# Altium project RFM95W915MHz.PrjPcb
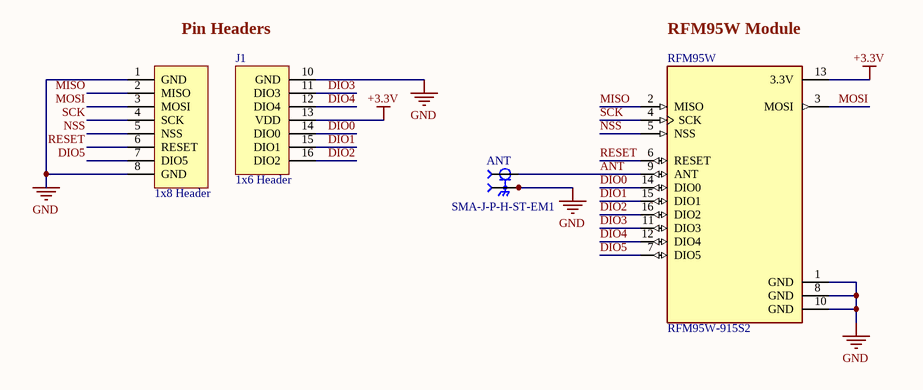
[diagram p0: RFM95W.SchDoc]
1 sheet, 4 parts. Net scope: global (net labels, ports and power ports of the same name join across sheets).
Board file: RFM95W.PcbDoc

## Sheet RFM95W.SchDoc
size A

### Parts
ANT  SMA-J-P-H-ST-EM1  [SAMTEC_SMA-J-P-H-ST-EM1]
J1  1x6 Header  [HDR1X7]
J2  1x8 Header  [HDR1X8]
RFM95W  RFM95W-915S2  [XCVR_RFM95W-915S2]

### Nets
+3.3V: J1.13(VDD) RFM95W.13(3.3V)
GND: ANT.2_1 ANT.2_2 ANT.3_1 ANT.3_2 J1.10(GND) J2.1(GND) J2.8(GND) RFM95W.1(GND) RFM95W.8(GND) RFM95W.10(GND)
ANT: ANT.1 RFM95W.9(ANT)
DIO0: J1.14(DIO0) RFM95W.14(DIO0)
DIO1: J1.15(DIO1) RFM95W.15(DIO1)
DIO2: J1.16(DIO2) RFM95W.16(DIO2)
DIO3: J1.11(DIO3) RFM95W.11(DIO3)
DIO4: J1.12(DIO4) RFM95W.12(DIO4)
DIO5: J2.7(DIO5) RFM95W.7(DIO5)
MISO: J2.2(MISO) RFM95W.2(MISO)
MOSI: J2.3(MOSI) RFM95W.3(MOSI)
NSS: J2.5(NSS) RFM95W.5(NSS)
RESET: J2.6(RESET) RFM95W.6(RESET)
SCK: J2.4(SCK) RFM95W.4(SCK)

### Notes on the sheet
- Pin Headers
- (near RFM95W) RFM95W Module

### Library data of the parts
ANT = SMA-J-P-H-ST-EM1: SMA Connector Jack, Female Socket 50Ohm Board Edge, End Launch Solder; MF: Samtec; SnapEDA_Link: https://www.snapeda.com/parts/SMA-J-P-H-ST-EM1/Samtec%20Inc./view-part/134500/?ref=snap; MP: SMA-J-P-H-ST-EM1; Toby_UK-Purchase-URL: https://snapeda.com/shop?store=Toby+UK&id=134500; Value: *; Package: None; Digi-Key_Part_Number: SAM8857-ND
J1 = 22-10-2061_1: CONN HEADER VERT 7POS 2.54MM; Manufacturer: Molex; Contact Resistance: 10mR; Number of Contacts: 6; Gender: Male; Current Rating: 4A; Voltage Rating: 250V; Insulation Resistance: 50GR; Connector Type: Male Pin; Glow Wire Compliant: Non-compliant; Supplier 1: Digi-Key; Manufacturer Part Number: 22-10-2061; RoHS: Yes; Category: Headers and Wire Housings; Stock 1: 3643; Pricing 1: 1=1.33000, 10=1.10400, 100=0.92000, 1000=0.73600, 5000=0.64400, 10000=0.61180 (USD); Mount: Through Hole; Contact Plating: Gold,Copper,Tin; Contact Material: Brass; Housing Color: Black; Housing Material: Nylon; Color: White; Min Operating Temperature: 0°C; Max Operating Temperature: 75°C; Number of Rows: 1; Packaging: Bulk; Termination: Solder; Orientation: Straight; Package Quantity: 10; Number of Positions: 6; Voltage Rating (DC): 250V; Number of Circuits: 6; Series: KK® 4030; Contact Type: Male Pin; Length: 95mm; Height: 14.68mm; Pitch: 2.54mm; Depth: 9.02mm; Contact Mating Length: 0.295inch; Radiation Hardening: No; RoHS Compliant: Yes; REACH SVHC: Unknown; Halogen Free: Low Halogen; Flammability Rating: UL94 V-0; ComponentLink1URL: https://datasheet.ciiva.com/711/022032041-sd-711929.pdf?src-supplier=Digi-Key; ComponentLink1Description: https://datasheet.ciiva.com/711/022032041-sd-711929.pdf?src-supplier=Digi-Key; ComponentLink2URL: https://datasheet.ciiva.com/5158/0022102061-pcb-headers-158488-5158499.pdf?src-supplier=Mouser; ComponentLink2Description: https://datasheet.ciiva.com/5158/0022102061-pcb-headers-158488-5158499.pdf?src-supplier=Mouser; ComponentLink3URL: https://datasheet.ciiva.com/10086/0022102061-pcb-headers-10086323.pdf?src-supplier=Avnet; ComponentLink3Description: https://datasheet.ciiva.com/10086/0022102061-pcb-headers-10086323.pdf?src-supplier=Avnet; ComponentLink4URL: https://datasheet.ciiva.com/19461/1965971-19461525.pdf?src-supplier=Jameco; ComponentLink4Description: https://datasheet.ciiva.com/19461/1965971-19461525.pdf?src-supplier=Jameco; ComponentLink5URL: https://datasheet.ciiva.com/30196/0022102061-pcb-headers-30196683.pdf?src-supplier=Onlinecomponents.com; ComponentLink5Description: https://datasheet.ciiva.com/30196/0022102061-pcb-headers-30196683.pdf?src-supplier=Onlinecomponents.com; ComponentLink6URL: https://datasheet.ciiva.com/16727/0022102061-pcb-headers-16727098.pdf?src-supplier=Avnet+Europe; ComponentLink6Description: https://datasheet.ciiva.com/16727/0022102061-pcb-headers-16727098.pdf?src-supplier=Avnet+Europe; Supplier Part Number 1: 23-0022102071-ND
J2 = 22-10-2061: CONN HEADER VERT 8POS 2.54MM; Manufacturer: Molex; Contact Resistance: 10mR; Number of Contacts: 6; Gender: Male; Current Rating: 4A; Voltage Rating: 250V; Insulation Resistance: 50GR; Connector Type: Male Pin; Glow Wire Compliant: Non-compliant; Supplier 1: Digi-Key; Manufacturer Part Number: 22-10-2061; RoHS: Yes; Category: Headers and Wire Housings; Stock 1: 3643; Pricing 1: 1=1.33000, 10=1.10400, 100=0.92000, 1000=0.73600, 5000=0.64400, 10000=0.61180 (USD); Mount: Through Hole; Contact Plating: Gold,Copper,Tin; Contact Material: Brass; Housing Color: Black; Housing Material: Nylon; Color: White; Min Operating Temperature: 0°C; Max Operating Temperature: 75°C; Number of Rows: 1; Packaging: Bulk; Termination: Solder; Orientation: Straight; Package Quantity: 10; Number of Positions: 6; Voltage Rating (DC): 250V; Number of Circuits: 6; Series: KK® 4030; Contact Type: Male Pin; Length: 95mm; Height: 14.68mm; Pitch: 2.54mm; Depth: 9.02mm; Contact Mating Length: 0.295inch; Radiation Hardening: No; RoHS Compliant: Yes; REACH SVHC: Unknown; Halogen Free: Low Halogen; Flammability Rating: UL94 V-0; ComponentLink1URL: https://datasheet.ciiva.com/711/022032041-sd-711929.pdf?src-supplier=Digi-Key; ComponentLink1Description: https://datasheet.ciiva.com/711/022032041-sd-711929.pdf?src-supplier=Digi-Key; ComponentLink2URL: https://datasheet.ciiva.com/5158/0022102061-pcb-headers-158488-5158499.pdf?src-supplier=Mouser; ComponentLink2Description: https://datasheet.ciiva.com/5158/0022102061-pcb-headers-158488-5158499.pdf?src-supplier=Mouser; ComponentLink3URL: https://datasheet.ciiva.com/10086/0022102061-pcb-headers-10086323.pdf?src-supplier=Avnet; ComponentLink3Description: https://datasheet.ciiva.com/10086/0022102061-pcb-headers-10086323.pdf?src-supplier=Avnet; ComponentLink4URL: https://datasheet.ciiva.com/19461/1965971-19461525.pdf?src-supplier=Jameco; ComponentLink4Description: https://datasheet.ciiva.com/19461/1965971-19461525.pdf?src-supplier=Jameco; ComponentLink5URL: https://datasheet.ciiva.com/30196/0022102061-pcb-headers-30196683.pdf?src-supplier=Onlinecomponents.com; ComponentLink5Description: https://datasheet.ciiva.com/30196/0022102061-pcb-headers-30196683.pdf?src-supplier=Onlinecomponents.com; ComponentLink6URL: https://datasheet.ciiva.com/16727/0022102061-pcb-headers-16727098.pdf?src-supplier=Avnet+Europe; ComponentLink6Description: https://datasheet.ciiva.com/16727/0022102061-pcb-headers-16727098.pdf?src-supplier=Avnet+Europe; Supplier Part Number 1: 23-0022102081-ND
RFM95W = RFM95W-915S2: RFM95(W) - Low Power Long Range Transceiver Module V1.0; MF: {'manufacturer': u'RF Solutions'}; Availability: Unavailable; MP: RFM95W-915S2; Package: None; Value: *; Price: None